# EAGLE schematic LampeSchaltplan (EAGLE 8.6.0)
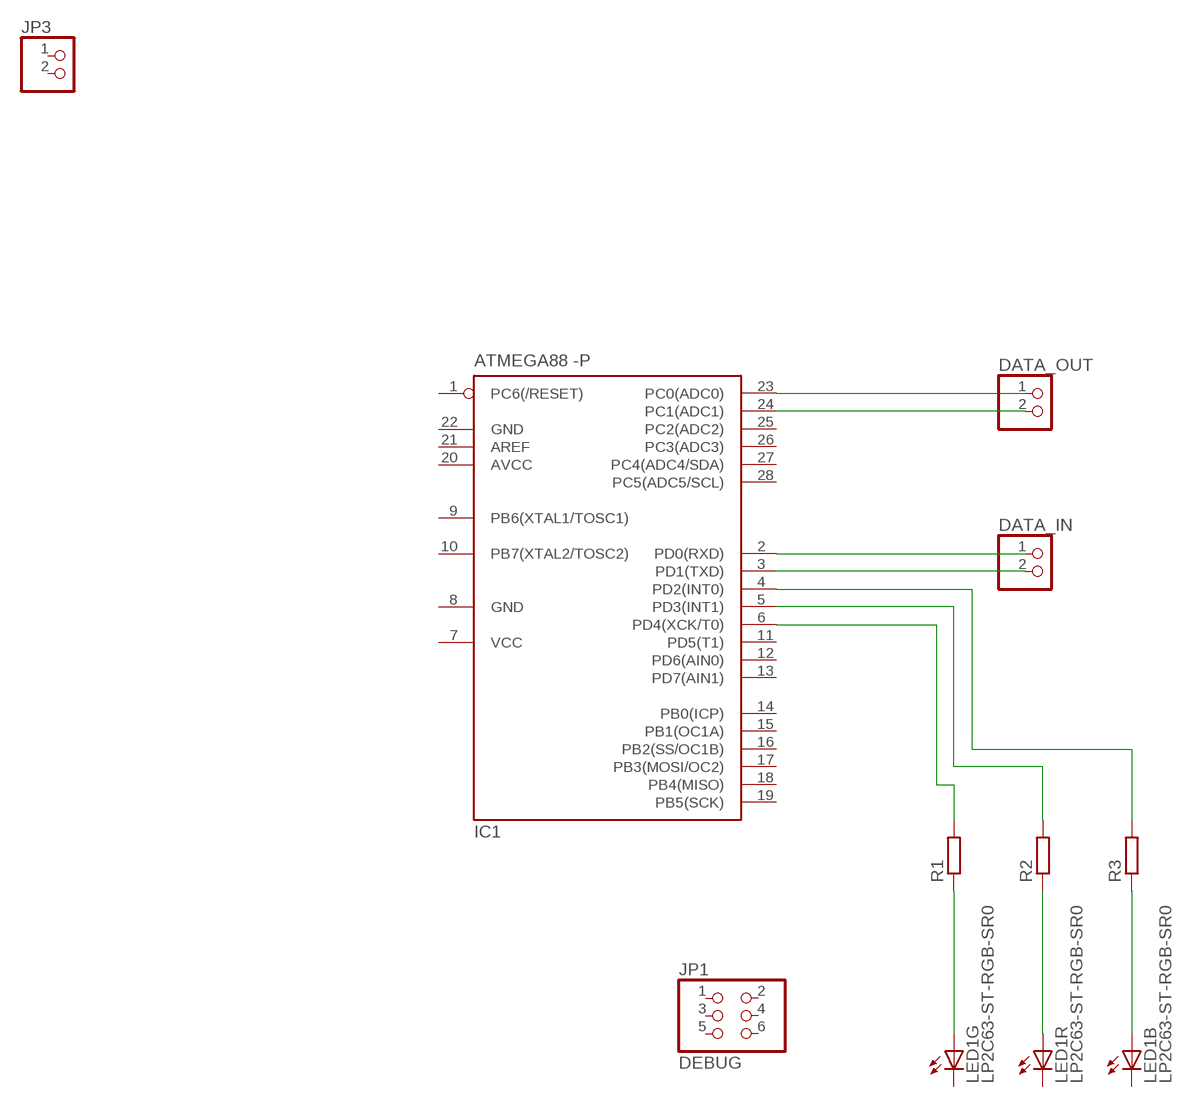
[diagram p0: schematic, sheet 1]

## Parts
DATA_IN  PINHD-1X2  [1X02]
DATA_OUT  PINHD-1X2  [1X02]
IC1  ATMEGA88 -P  MEGA8-P  [DIL28-3]
JP1  DEBUG  PINHD-2X3  [2X03]
JP3  PINHD-1X2  [1X02]
LED1  LP2C63-ST-RGB-SR0  [LP2C63-ST-RGB-SR0]
R1  R-EU_M0805  [M0805]
R2  R-EU_M0805  [M0805]
R3  R-EU_M0805  [M0805]

## Nets
N$1: LED1.1(G:A) R1.1
N$2: LED1.2(R:A) R2.1
N$3: LED1.3(B:A) R3.1
N$4: DATA_IN.2 IC1.3(PD1(TXD))
N$5: DATA_IN.1 IC1.2(PD0(RXD))
N$6: DATA_OUT.2 IC1.24(PC1(ADC1))
N$7: DATA_OUT.1 IC1.23(PC0(ADC0))
N$8: IC1.4(PD2(INT0)) R3.2
N$9: IC1.5(PD3(INT1)) R2.2
N$10: IC1.6(PD4(XCK/T0)) R1.2
Unconnected: IC1.1(PC6(/RESET)) IC1.9(PB6(XTAL1/TOSC1)) IC1.10(PB7(XTAL2/TOSC2)) IC1.11(PD5(T1)) IC1.12(PD6(AIN0)) IC1.13(PD7(AIN1)) IC1.14(PB0(ICP)) IC1.15(PB1(OC1A)) IC1.16(PB2(SS/OC1B)) IC1.17(PB3(MOSI/OC2)) IC1.18(PB4(MISO)) IC1.19(PB5(SCK)) IC1.21(AREF) IC1.25(PC2(ADC2)) IC1.26(PC3(ADC3)) IC1.27(PC4(ADC4/SDA)) IC1.28(PC5(ADC5/SCL)) JP1.1 JP1.2 JP1.3 JP1.4 JP1.5 JP1.6 JP3.1 JP3.2 LED1.4(B:C) LED1.5(R:C) LED1.6(G:C) LED1.TH(TH:TH)

## Power pins joined to a net without a drawn wire
AVCC: IC1.20(AVCC)
GND: IC1.8(GND) IC1.22(GND)
VCC: IC1.7(VCC)

## Library data of the parts
DATA_IN DATA_OUT JP3 = pinhead:PINHD-1X2: PIN HEADER
IC1 = atmel:MEGA8-P: MICROCONTROLLER 8 Kbytes FLASH, 1 kbytes SRAM, 512 bytes EEPROM, USART, 4-channel 10 bit ADC, 2-channel 8 bit ADC Pin compatible with Atmega48, ATMega88, ATMega168 Source: avr.lbr; OC_FARNELL: unknown; OC_NEWARK: unknown
JP1 = pinhead:PINHD-2X3: PIN HEADER
LED1 = led:LP2C63-ST-RGB-SR0: 1.5W RGB HIGH POWER LED Source: http://www.ledtech.com.tw .. LP2C63-ST-RGB-SR0.SPEC.pdf
R1-R3 = rcl:R-EU_: RESISTOR, European symbol; SPICEPREFIX: R